# Altium schematic sheet PCM1802_StereoADC.SchDoc
size A4; SheetNumber: 9; SheetTotal: 9
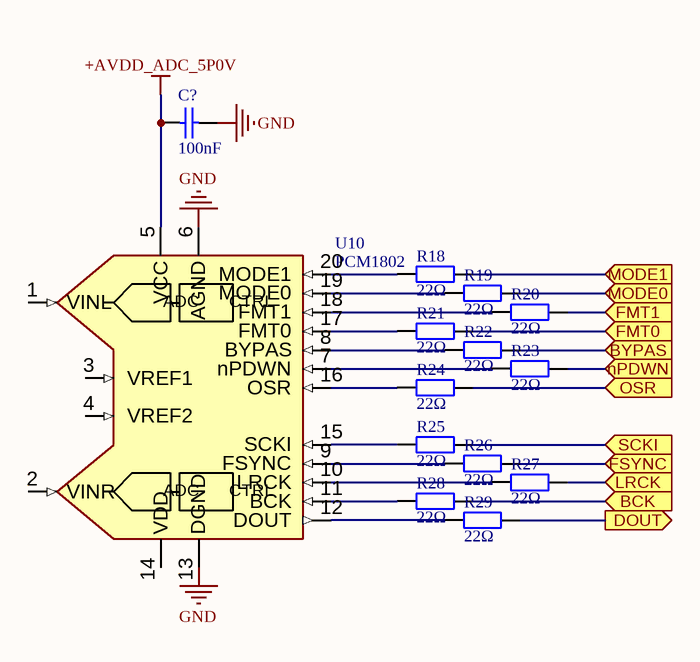
[diagram p0: PCM1802_StereoADC.SchDoc]

## Parts
C?  100nF  [0603_C]
R18  22Ω  [0603_R]
R19  22Ω  [0603_R]
R20  22Ω  [0603_R]
R21  22Ω  [0603_R]
R22  22Ω  [0603_R]
R23  22Ω  [0603_R]
R24  22Ω  [0603_R]
R25  22Ω  [0603_R]
R26  22Ω  [0603_R]
R27  22Ω  [0603_R]
R28  22Ω  [0603_R]
R29  22Ω  [0603_R]
U10  PCM1802  [SOP65P780X200-20N]

## Ports
BCK (in), BYPAS (in), DOUT (out), FMT0 (in), FMT1 (in), FSYNC (in), LRCK (in), MODE0 (in), MODE1 (in), nPDWN (in), OSR (in), SCKI (in)

## Nets
+AVDD_ADC_5P0V: C?.1 U10.5(VCC)
GND: C?.2 U10.6(AGND) U10.13(DGND)
BCK: R28.2 ; port BCK
BYPAS: R22.2 ; port BYPAS
DOUT: R29.2 ; port DOUT
FMT0: R21.2 ; port FMT0
FMT1: R20.2 ; port FMT1
FSYNC: R26.2 ; port FSYNC
LRCK: R27.2 ; port LRCK
MODE0: R19.2 ; port MODE0
MODE1: R18.2 ; port MODE1
nPDWN: R23.2 ; port nPDWN
OSR: R24.2 ; port OSR
SCKI: R25.2 ; port SCKI
NetR18_1: R18.1 U10.20(MODE1)
NetR19_1: R19.1 U10.19(MODE0)
NetR20_1: R20.1 U10.18(FMT1)
NetR21_1: R21.1 U10.17(FMT0)
NetR22_1: R22.1 U10.8(BYPAS)
NetR23_1: R23.1 U10.7(nPDWN)
NetR24_1: R24.1 U10.16(OSR)
NetR25_1: R25.1 U10.15(SCKI)
NetR26_1: R26.1 U10.9(FSYNC)
NetR27_1: R27.1 U10.10(LRCK)
NetR28_1: R28.1 U10.11(BCK)
NetR29_1: R29.1 U10.12(DOUT)

Not connected (* = marked no-connect by the designer): U10 1(VINL) 2(VINR) 3(VREF1) 4(VREF2) 14(VDD)

## Notes on the sheet
- (in symbol PCM1802) ADC; CTRL

## Library data of the parts
C? = 0603 100nF (104) 10% 50V: 贴片电容; ComponentLink1Description: 供应商链接; ComponentLink1URL: http://www.szlcsc.com/product/details_15331.html; Package: 0603; Supplier: LC; SuppliersPartNumber: C14663
R18-R29 = 0603 22Ω (22R0) 1%: 贴片电阻; ComponentLink1Description: 供应商链接; ComponentLink1URL: http://www.szlcsc.com/product/details_24078.html; Package: 0603; Supplier: LC; SuppliersPartNumber: C23345